# Altium project Test_Carrier.PrjPcb
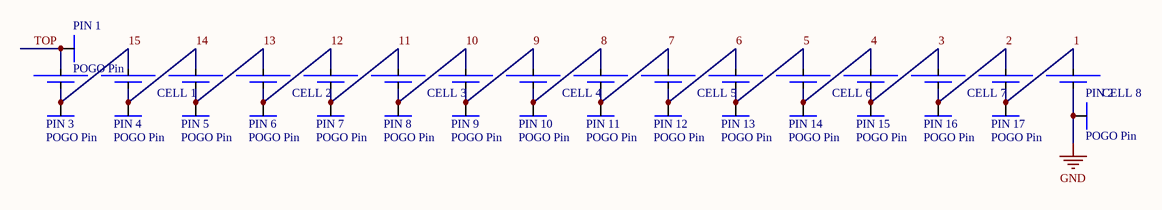
[diagram p0: Carrier.SchDoc]
1 sheet, 25 parts. Net scope: global (net labels, ports and power ports of the same name join across sheets).
Board file: Slave.PcbDoc

## Sheet Carrier.SchDoc
size A

### Parts
CELL_1  Dual 18650 Holder  - Keystone 1048P  [2x18650 Holder]  (value not drawn)
CELL_2  Dual 18650 Holder  - Keystone 1048P  [2x18650 Holder]  (value not drawn)
CELL_3  Dual 18650 Holder  - Keystone 1048P  [2x18650 Holder]  (value not drawn)
CELL_4  Dual 18650 Holder  - Keystone 1048P  [2x18650 Holder]  (value not drawn)
CELL_5  Dual 18650 Holder  - Keystone 1048P  [2x18650 Holder]  (value not drawn)
CELL_6  Dual 18650 Holder  - Keystone 1048P  [2x18650 Holder]  (value not drawn)
CELL_7  Dual 18650 Holder  - Keystone 1048P  [2x18650 Holder]  (value not drawn)
CELL_8  Dual 18650 Holder  - Keystone 1048P  [2x18650 Holder]  (value not drawn)
PIN_1  POGO Pin  [Pogo Pin]
PIN_2  POGO Pin  [Pogo Pin]
PIN_3  POGO Pin  [Pogo Pin]
PIN_4  POGO Pin  [Pogo Pin]
PIN_5  POGO Pin  [Pogo Pin]
PIN_6  POGO Pin  [Pogo Pin]
PIN_7  POGO Pin  [Pogo Pin]
PIN_8  POGO Pin  [Pogo Pin]
PIN_9  POGO Pin  [Pogo Pin]
PIN_10  POGO Pin  [Pogo Pin]
PIN_11  POGO Pin  [Pogo Pin]
PIN_12  POGO Pin  [Pogo Pin]
PIN_13  POGO Pin  [Pogo Pin]
PIN_14  POGO Pin  [Pogo Pin]
PIN_15  POGO Pin  [Pogo Pin]
PIN_16  POGO Pin  [Pogo Pin]
PIN_17  POGO Pin  [Pogo Pin]

### Nets
GND: CELL_8.-2 PIN_2.1
1: CELL_8.+2 CELL_8.-1 PIN_17.1
2: CELL_7.-2 CELL_8.+1 PIN_16.1
3: CELL_7.+2 CELL_7.-1 PIN_15.1
4: CELL_6.-2 CELL_7.+1 PIN_14.1
5: CELL_6.+2 CELL_6.-1 PIN_13.1
6: CELL_5.-2 CELL_6.+1 PIN_12.1
7: CELL_5.+2 CELL_5.-1 PIN_11.1
8: CELL_4.-2 CELL_5.+1 PIN_10.1
9: CELL_4.+2 CELL_4.-1 PIN_9.1
10: CELL_3.-2 CELL_4.+1 PIN_8.1
11: CELL_3.+2 CELL_3.-1 PIN_7.1
12: CELL_2.-2 CELL_3.+1 PIN_6.1
13: CELL_2.+2 CELL_2.-1 PIN_5.1
14: CELL_1.-2 CELL_2.+1 PIN_4.1
15: CELL_1.+2 CELL_1.-1 PIN_3.1
TOP: CELL_1.+1 PIN_1.1

### Library data of the parts
CELL_1-CELL_8 = 2x18650 Holder